# Altium schematic sheet Counters.SchDoc
size A
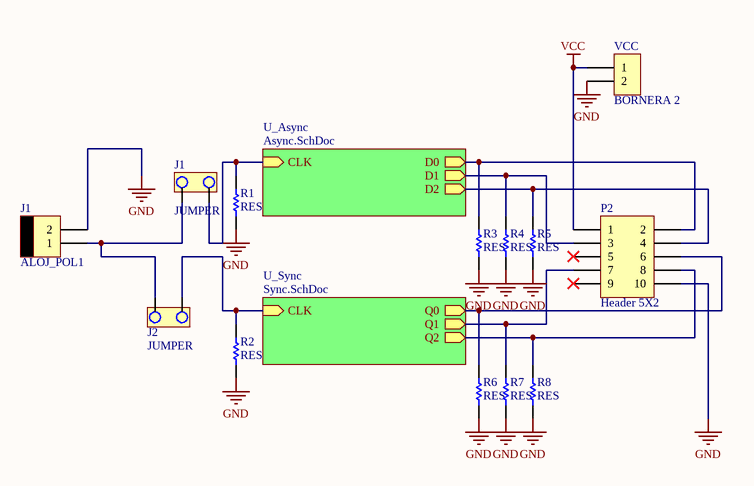
[diagram p0: Counters.SchDoc]

## Parts
(Parts that share a designator on the sheet are numbered #1, #2 ... from top to bottom, then left to right.)
J1#1  JUMPER  [JUMPER2]
J1#2  ALOJ_POL1  [MOLEX2]
J2  JUMPER  [JUMPER2]
P2  Header 5X2  [HDR2X5]
R1  RES  [RES400]
R2  RES  [RES400]
R3  RES  [RES400]
R4  RES  [RES400]
R5  RES  [RES400]
R6  RES  [RES400]
R7  RES  [RES400]
R8  RES  [RES400]
VCC  BORNERA 2  [BORNERA2]

## Sub-sheets
U_Async = Async.SchDoc: CLK (in), D0 (out), D1 (out), D2 (out)
U_Sync = Sync.SchDoc: Q0 (out), Q1 (out), Q2 (out), CLK (in)

## Nets
GND: J1#2.2 P2.10 R1.1 R2.1 R3.1 R4.1 R5.1 R6.1 R7.1 R8.1 VCC.2
VCC: P2.1 VCC.1
NetJ1#1_1: J1#1.1 R1.2 ; sheet U_Async/CLK
NetJ1#1_2: J1#1.2 J1#2.1 J2.1
NetJ2_2: J2.2 R2.2 ; sheet U_Sync/CLK
NetP2_2: P2.2 R3.2 ; sheet U_Async/D0
NetP2_3: P2.3 R4.2 ; sheet U_Async/D1
NetP2_4: P2.4 R5.2 ; sheet U_Async/D2
NetP2_6: P2.6 R6.2 ; sheet U_Sync/Q0
NetP2_7: P2.7 R7.2 ; sheet U_Sync/Q1
NetP2_8: P2.8 R8.2 ; sheet U_Sync/Q2

Not connected (* = marked no-connect by the designer): P2 5* 9*

## Library data of the parts
J1#2 = MOLEX2
P2 = Header 5X2: Header, 5-Pin, Dual row; LatestRevisionDate: 17-Jul-2002; LatestRevisionNote: Re-released for DXP Platform.; Publisher: Altium Limited